# EAGLE design main (EAGLE 7.4.0)
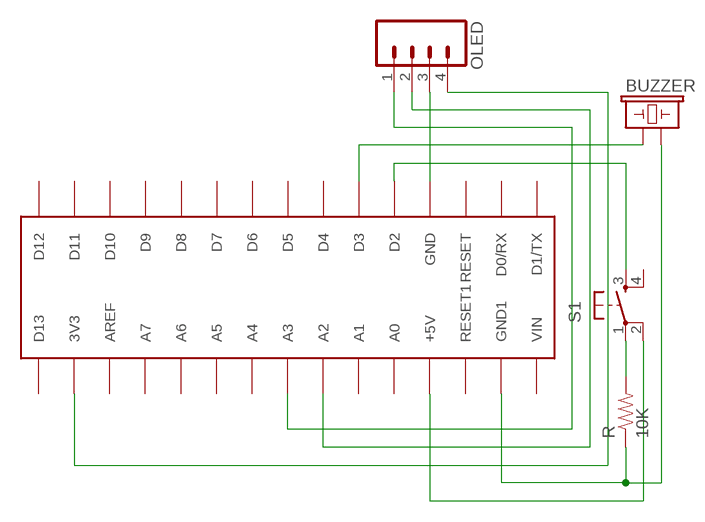
[diagram p0: schematic, sheet 1]

## Parts
BUZZER  BUZZERPTH  [BUZZER-12MM]
NANO  ARDUINONANO  [PDIP-32]
OLED  M04LOCK_LONGPADS  [1X04_LOCK_LONGPADS]
R  10K  RESISTORAXIAL-0.3  [AXIAL-0.3]
S1  TAC_SWITCHPTH  [TACTILE-PTH]

## Nets
N$1: BUZZER.+ NANO.D3
N$3: NANO.A3 OLED.1
N$4: NANO.A2 OLED.2
N$5: NANO.GND OLED.3
N$6: R.P$2 S1.1
N$7: NANO.+5V S1.2
N$8: NANO.3V3 OLED.4
N$9: NANO.D2 S1.3
N$11: BUZZER.- NANO.GND1 R.P$1
Unconnected: NANO.A0 NANO.A1 NANO.A4 NANO.A5 NANO.A6 NANO.A7 NANO.AREF NANO.D0/RX NANO.D1/TX NANO.D4 NANO.D5 NANO.D6 NANO.D7 NANO.D8 NANO.D9 NANO.D10 NANO.D11 NANO.D12 NANO.D13 NANO.RESET NANO.RESET1 NANO.VIN S1.4

## Library data of the parts
BUZZER = SparkFun-Electromechanical:BUZZER: Buzzer 12mm Spark Fun Electronics SKU : Comp-Buzzer
NANO = arduino_nano:ARDUINONANO
OLED = SparkFun-Connectors:M04: Header 4 Standard 4-pin 0.1" header. Use with straight break away headers (SKU : PRT-00116), right angle break away headers (PRT-00553), swiss pins (PRT-00743), machine pins (PRT-00117), and female headers (PRT-00115). Molex polarized connector foot print use with SKU : PRT-08231 with associated crimp pins and housings. 1MM SMD Version SKU: PRT-10208
R = SparkFun-Passives:RESISTOR: Resistor Basic schematic elements and footprints for 0603, 1206, and PTH resistors.
S1 = SparkFun-Retired:TAC_SWITCH: Momentary Switch Button commonly used for reset or general input. Spark Fun Electronics SKU : COM-00097 SMT- SWCH-08247

## Board
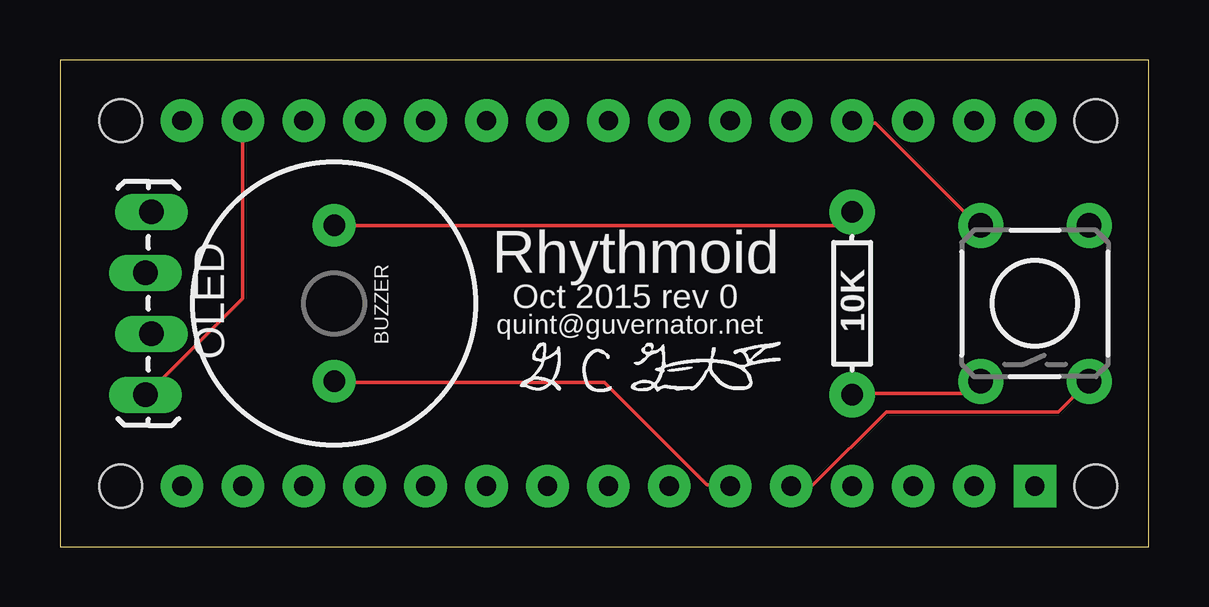
[diagram p1: board, top side]
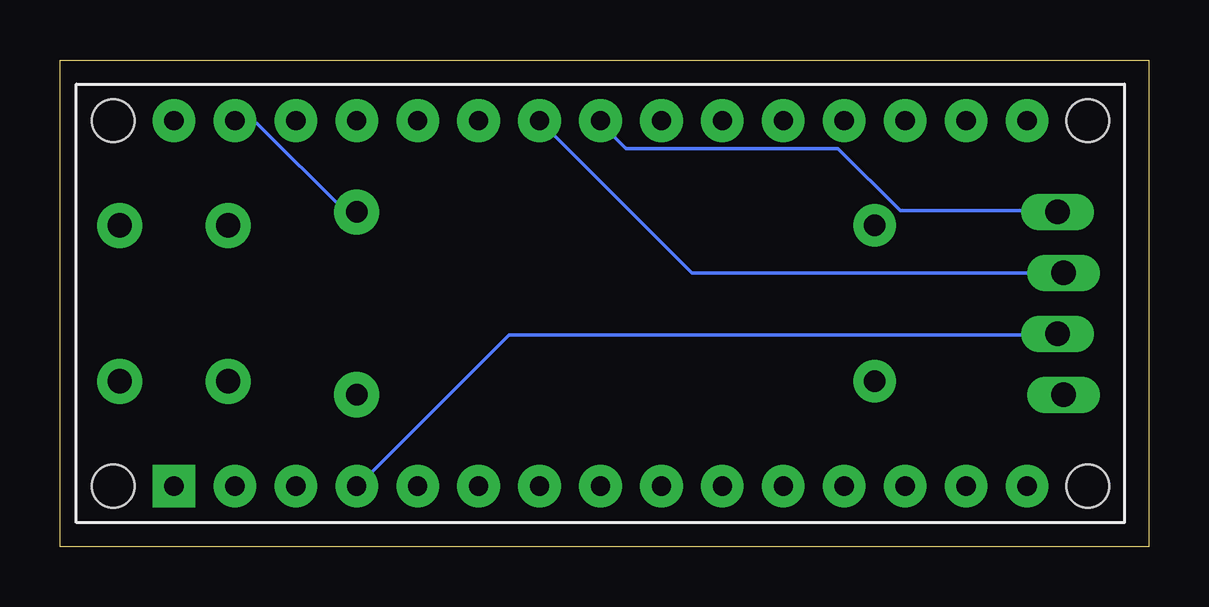
[diagram p2: board, bottom side, seen from below]

Size 45.39 x 20.31 mm. Coordinates in mm from the lower left corner, seen from the top.
Outline: 0,0 45.39,0 45.39,20.31 0,20.31 0,0
Copper layers (1*16): Top 0.0356mm / dielectric 1.5011mm / Bottom 0.0356mm
Design rules "OSH Park": minimum track width 6mil, minimum drill 13mil, track to track 6mil, track to pad 6mil, pad to pad 6mil, via to via 6mil, smd to smd 6mil, copper to edge 15mil, drill to drill 6mil, minimum pad ring 7mil, minimum via ring 7mil, stop-mask expansion 3mil, vias tented up to drill 0mil, thermal gap 10mil

### Footprints (pad centres in the part's own frame; a part is rotated, then mirrored left to right if it is on the bottom)
BUZZER-12MM = drill 0.9 pad 1.778: + 3.25,0; - -3.25,0
PDIP-32 = drill 0.8 pad 1.778: 3V3 15.24,-35.56; +5V 15.24,-10.16; A0 15.24,-12.7; A1 15.24,-15.24; A2 15.24,-17.78; A3 15.24,-20.32; A4 15.24,-22.86; A5 15.24,-25.4; A6 15.24,-27.94; A7 15.24,-30.48; AREF 15.24,-33.02; D0/RX 0,-5.08; D2 0,-12.7; D3 0,-15.24; D4 0,-17.78; D5 0,-20.32; D6 0,-22.86; D7 0,-25.4; D8 0,-27.94; D9 0,-30.48; D10 0,-33.02; D11 0,-35.56; D12 0,-38.1; D13 15.24,-38.1; GND 0,-10.16; GND1 15.24,-5.08; RESET 0,-7.62; RESET1 15.24,-7.62; VIN 15.24,-2.54 | drill 0.8 pad 1.778 square: D1/TX 0,-2.54 | hole 1.778: 0,0; 0,-40.64; 15.24,-40.64; 15.24,0
1X04_LOCK_LONGPADS = drill 1.016 long: 1 0,0; 2 2.54,-0.254; 3 5.08,0; 4 7.62,-0.254
AXIAL-0.3 = drill 0.9 pad 1.88: P$1 -3.81,0; P$2 3.81,0
TACTILE-PTH = drill 1.016 pad 1.88: 1 -3.251,2.261; 2 3.251,2.261; 3 -3.251,-2.261; 4 3.251,-2.261

### Placement (x,y rotation side)
BUZZER  11.43,10.16 270 top
NANO  43.18,2.54 90 bottom
OLED  3.81,13.97 270 top
R  33.02,10.16 270 top
S1  40.64,10.16 90 top

### Tracks (layer width: path | path; a pad name or v marks a point on that pad's centre or on a via)
N$1
  Top 0.152: NANO.D3 27.89,2.59 26.98,2.59 22.71,6.86 11.43,6.86 BUZZER.+
N$3
  Bottom 0.152: OLED.1 3.81,14.02 10.36,14.02 12.95,16.61 21.79,16.61 22.86,17.68 NANO.A3
N$4
  Bottom 0.152: OLED.2 19.05,11.43 NANO.A2
N$5
  Bottom 0.152: OLED.3 3.81,8.84 26.67,8.84 32.92,2.59 NANO.GND
N$6
  Top 0.152: R.P$2 33.07,6.4 37.8,6.4 38.25,6.86 S1.1
N$7
  Top 0.152: NANO.+5V 33.07,17.68 33.98,17.68 38.25,13.41 S1.2
N$8
  Top 0.152: NANO.3V3 7.62,10.36 3.66,6.4 OLED.4
N$9
  Top 0.152: NANO.D2 30.48,2.59 31.39,2.59 34.44,5.64 41.6,5.64 42.82,6.86 S1.3
N$11
  Top 0.152: R.P$1 32.46,13.41 BUZZER.-
  Bottom 0.152: NANO.GND1 38.1,17.68 37.19,17.68 33.53,14.02 33.07,14.02 R.P$1

### Text on the board
tPlace: Rhythmoid | Oct 2015 rev 0 | quint@guvernator.net